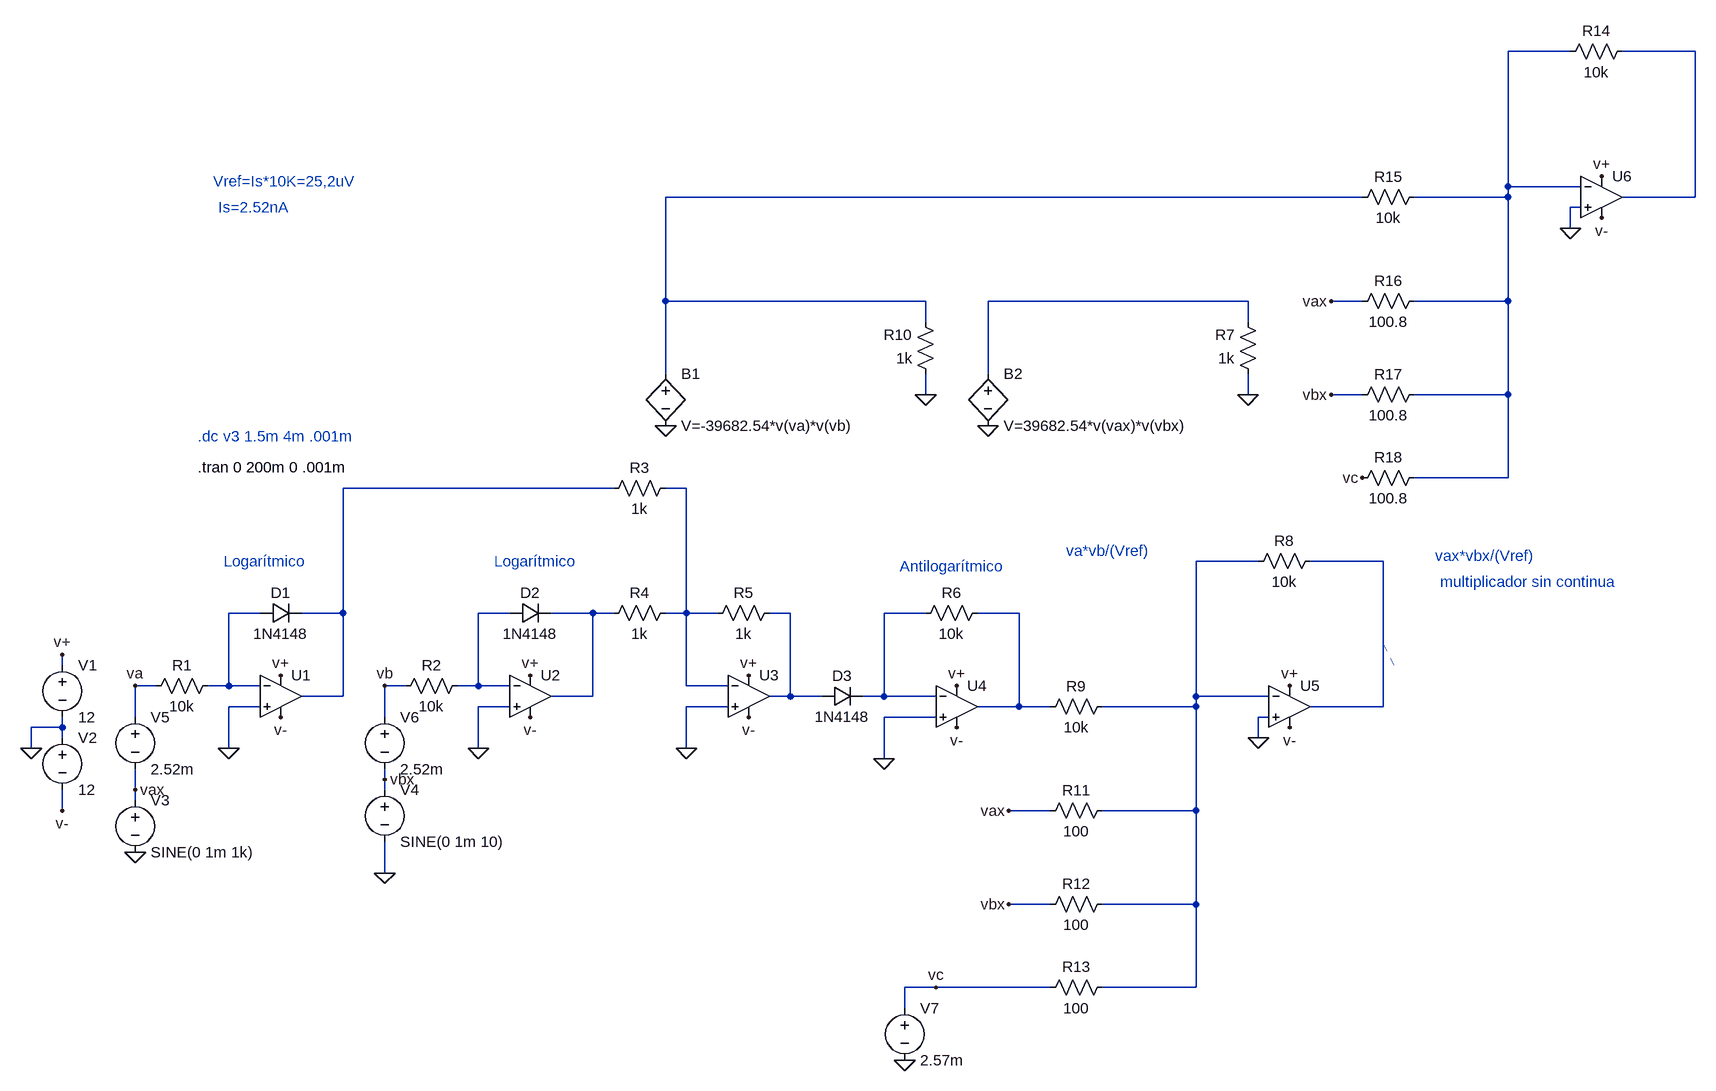
[diagram p0: schematic Multiplicador.asc]
Multiplicador.asc, the LTspice schematic file:
Version 4
SHEET 1 1492 680
WIRE 1296 -1200 1200 -1200
WIRE 1488 -1200 1376 -1200
WIRE 1200 -992 1200 -1200
WIRE 1312 -992 1200 -992
WIRE 976 -976 -96 -976
WIRE 1200 -976 1200 -992
WIRE 1200 -976 1056 -976
WIRE 1488 -976 1488 -1200
WIRE 1488 -976 1376 -976
WIRE 1312 -960 1296 -960
WIRE 1296 -928 1296 -960
WIRE -96 -816 -96 -976
WIRE 304 -816 -96 -816
WIRE 800 -816 400 -816
WIRE 976 -816 928 -816
WIRE 1200 -816 1200 -976
WIRE 1200 -816 1056 -816
WIRE 304 -784 304 -816
WIRE 800 -784 800 -816
WIRE -96 -704 -96 -816
WIRE 400 -704 400 -816
WIRE 304 -672 304 -704
WIRE 800 -672 800 -704
WIRE 976 -672 928 -672
WIRE 1200 -672 1200 -816
WIRE 1200 -672 1056 -672
WIRE 1200 -544 1200 -672
WIRE 1200 -544 1056 -544
WIRE -176 -528 -592 -528
WIRE -64 -528 -96 -528
WIRE 816 -416 720 -416
WIRE 1008 -416 896 -416
WIRE -720 -336 -768 -336
WIRE -592 -336 -592 -528
WIRE -592 -336 -656 -336
WIRE -336 -336 -384 -336
WIRE -208 -336 -272 -336
WIRE -176 -336 -208 -336
WIRE -64 -336 -64 -528
WIRE -64 -336 -96 -336
WIRE -16 -336 -64 -336
WIRE 96 -336 64 -336
WIRE 304 -336 240 -336
WIRE 448 -336 384 -336
WIRE -1024 -256 -1024 -272
WIRE -880 -224 -912 -224
WIRE -768 -224 -768 -336
WIRE -768 -224 -800 -224
WIRE -720 -224 -768 -224
WIRE -496 -224 -528 -224
WIRE -384 -224 -384 -336
WIRE -384 -224 -416 -224
WIRE -336 -224 -384 -224
WIRE -64 -224 -64 -336
WIRE 0 -224 -64 -224
WIRE -592 -208 -592 -336
WIRE -592 -208 -656 -208
WIRE -208 -208 -208 -336
WIRE -208 -208 -272 -208
WIRE 96 -208 96 -336
WIRE 96 -208 64 -208
WIRE 144 -208 96 -208
WIRE 240 -208 240 -336
WIRE 240 -208 208 -208
WIRE 320 -208 240 -208
WIRE 720 -208 720 -416
WIRE 832 -208 720 -208
WIRE -720 -192 -768 -192
WIRE -336 -192 -384 -192
WIRE 0 -192 -64 -192
WIRE 448 -192 448 -336
WIRE 448 -192 384 -192
WIRE 496 -192 448 -192
WIRE 720 -192 720 -208
WIRE 720 -192 576 -192
WIRE 1008 -192 1008 -416
WIRE 1008 -192 896 -192
WIRE -912 -176 -912 -224
WIRE -528 -176 -528 -224
WIRE 320 -176 240 -176
WIRE 832 -176 816 -176
WIRE -1024 -160 -1024 -176
WIRE -1024 -160 -1072 -160
WIRE -1024 -144 -1024 -160
WIRE 816 -144 816 -176
WIRE -1072 -128 -1072 -160
WIRE -768 -128 -768 -192
WIRE -384 -128 -384 -192
WIRE -64 -128 -64 -192
WIRE 240 -112 240 -176
WIRE -528 -80 -528 -96
WIRE -912 -64 -912 -96
WIRE -528 -64 -528 -80
WIRE -912 -48 -912 -64
WIRE -1024 -32 -1024 -64
WIRE 496 -32 432 -32
WIRE 720 -32 720 -192
WIRE 720 -32 576 -32
WIRE -528 64 -528 16
WIRE 496 112 432 112
WIRE 720 112 720 -32
WIRE 720 112 576 112
WIRE 320 240 272 240
WIRE 496 240 320 240
WIRE 720 240 720 112
WIRE 720 240 576 240
WIRE 272 272 272 240
FLAG -1072 -128 0
FLAG -912 32 0
FLAG -768 -128 0
FLAG -528 64 0
FLAG -384 -128 0
FLAG -64 -128 0
FLAG 240 -112 0
FLAG -912 -224 va
FLAG -528 -224 vb
FLAG -96 -624 0
FLAG 304 -672 0
FLAG -1024 -272 v+
FLAG -688 -240 v+
FLAG -304 -240 v+
FLAG 32 -240 v+
FLAG 352 -224 v+
FLAG -1024 -32 v-
FLAG -688 -176 v-
FLAG -304 -176 v-
FLAG 32 -176 v-
FLAG 352 -160 v-
FLAG -912 -64 vax
FLAG -528 -80 vbx
FLAG 400 -624 0
FLAG 800 -672 0
FLAG 864 -224 v+
FLAG 864 -160 v-
FLAG 816 -144 0
FLAG 432 -32 vax
FLAG 432 112 vbx
FLAG 272 352 0
FLAG 1344 -1008 v+
FLAG 1344 -944 v-
FLAG 1296 -928 0
FLAG 928 -816 vax
FLAG 928 -672 vbx
FLAG 320 240 vc
FLAG 976 -544 vc
SYMBOL Opamps\\UniversalOpamp2 -688 -208 R0
SYMATTR InstName U1
SYMBOL diode -720 -320 R270
WINDOW 0 32 32 VTop 2
WINDOW 3 0 32 VBottom 2
SYMATTR InstName D1
SYMATTR Value 1N4148
SYMBOL voltage -1024 -272 R0
WINDOW 123 0 0 Left 2
WINDOW 39 0 0 Left 2
SYMATTR InstName V1
SYMATTR Value 12
SYMBOL voltage -1024 -160 R0
WINDOW 123 0 0 Left 2
WINDOW 39 0 0 Left 2
SYMATTR InstName V2
SYMATTR Value 12
SYMBOL res -784 -240 R90
WINDOW 0 0 56 VBottom 2
WINDOW 3 32 56 VTop 2
SYMATTR InstName R1
SYMATTR Value 10k
SYMBOL voltage -912 -64 R0
WINDOW 123 0 0 Left 2
WINDOW 39 0 0 Left 2
SYMATTR InstName V3
SYMATTR Value SINE(0 1m 1k)
SYMBOL Opamps\\UniversalOpamp2 -304 -208 R0
SYMATTR InstName U2
SYMBOL diode -336 -320 R270
WINDOW 0 32 32 VTop 2
WINDOW 3 0 32 VBottom 2
SYMATTR InstName D2
SYMATTR Value 1N4148
SYMBOL res -400 -240 R90
WINDOW 0 0 56 VBottom 2
WINDOW 3 32 56 VTop 2
SYMATTR InstName R2
SYMATTR Value 10k
SYMBOL voltage -528 -80 R0
WINDOW 123 0 0 Left 2
WINDOW 39 0 0 Left 2
SYMATTR InstName V4
SYMATTR Value SINE(0 1m 10)
SYMBOL Opamps\\UniversalOpamp2 32 -208 R0
SYMATTR InstName U3
SYMBOL res -80 -544 R90
WINDOW 0 0 56 VBottom 2
WINDOW 3 32 56 VTop 2
SYMATTR InstName R3
SYMATTR Value 1k
SYMBOL res -80 -352 R90
WINDOW 0 0 56 VBottom 2
WINDOW 3 32 56 VTop 2
SYMATTR InstName R4
SYMATTR Value 1k
SYMBOL res 80 -352 R90
WINDOW 0 0 56 VBottom 2
WINDOW 3 32 56 VTop 2
SYMATTR InstName R5
SYMATTR Value 1k
SYMBOL Opamps\\UniversalOpamp2 352 -192 R0
SYMATTR InstName U4
SYMBOL diode 144 -192 R270
WINDOW 0 32 32 VTop 2
WINDOW 3 0 32 VBottom 2
SYMATTR InstName D3
SYMATTR Value 1N4148
SYMBOL res 400 -352 R90
WINDOW 0 0 56 VBottom 2
WINDOW 3 32 56 VTop 2
SYMATTR InstName R6
SYMATTR Value 10k
SYMBOL bv -96 -720 R0
SYMATTR InstName B1
SYMATTR Value V=-39682.54*v(va)*v(vb)
SYMBOL res 320 -688 R180
WINDOW 0 36 76 Left 2
WINDOW 3 36 40 Left 2
SYMATTR InstName R10
SYMATTR Value 1k
SYMBOL voltage -912 -192 R0
WINDOW 123 0 0 Left 0
WINDOW 39 0 0 Left 0
SYMATTR InstName V5
SYMATTR Value 2.52m
SYMBOL voltage -528 -192 R0
WINDOW 123 0 0 Left 0
WINDOW 39 0 0 Left 0
SYMATTR InstName V6
SYMATTR Value 2.52m
SYMBOL bv 400 -720 R0
SYMATTR InstName B2
SYMATTR Value V=39682.54*v(vax)*v(vbx)
SYMBOL res 816 -688 R180
WINDOW 0 36 76 Left 2
WINDOW 3 36 40 Left 2
SYMATTR InstName R7
SYMATTR Value 1k
SYMBOL Opamps\\UniversalOpamp2 864 -192 R0
SYMATTR InstName U5
SYMBOL res 912 -432 R90
WINDOW 0 0 56 VBottom 2
WINDOW 3 32 56 VTop 2
SYMATTR InstName R8
SYMATTR Value 10k
SYMBOL res 592 -208 R90
WINDOW 0 0 56 VBottom 2
WINDOW 3 32 56 VTop 2
SYMATTR InstName R9
SYMATTR Value 10k
SYMBOL res 592 -48 R90
WINDOW 0 0 56 VBottom 2
WINDOW 3 32 56 VTop 2
SYMATTR InstName R11
SYMATTR Value 100
SYMBOL res 592 96 R90
WINDOW 0 0 56 VBottom 2
WINDOW 3 32 56 VTop 2
SYMATTR InstName R12
SYMATTR Value 100
SYMBOL res 592 224 R90
WINDOW 0 0 56 VBottom 2
WINDOW 3 32 56 VTop 2
SYMATTR InstName R13
SYMATTR Value 100
SYMBOL voltage 272 256 R0
WINDOW 123 0 0 Left 0
WINDOW 39 0 0 Left 0
SYMATTR InstName V7
SYMATTR Value 2.57m
SYMBOL Opamps\\UniversalOpamp2 1344 -976 R0
SYMATTR InstName U6
SYMBOL res 1392 -1216 R90
WINDOW 0 0 56 VBottom 2
WINDOW 3 32 56 VTop 2
SYMATTR InstName R14
SYMATTR Value 10k
SYMBOL res 1072 -992 R90
WINDOW 0 0 56 VBottom 2
WINDOW 3 32 56 VTop 2
SYMATTR InstName R15
SYMATTR Value 10k
SYMBOL res 1072 -832 R90
WINDOW 0 0 56 VBottom 2
WINDOW 3 32 56 VTop 2
SYMATTR InstName R16
SYMATTR Value 100.8
SYMBOL res 1072 -688 R90
WINDOW 0 0 56 VBottom 2
WINDOW 3 32 56 VTop 2
SYMATTR InstName R17
SYMATTR Value 100.8
SYMBOL res 1072 -560 R90
WINDOW 0 0 56 VBottom 2
WINDOW 3 32 56 VTop 2
SYMATTR InstName R18
SYMATTR Value 100.8
TEXT -816 -608 Left 2 ;.dc v3 1.5m 4m .001m
TEXT -816 -560 Left 2 !.tran 0 200m 0 .001m
TEXT -776 -416 Left 2 ;Logarítmico
TEXT -360 -416 Left 2 ;Logarítmico
TEXT 264 -408 Left 2 ;Antilogarítmico
TEXT 520 -432 Left 2 ;va*vb/(Vref)
TEXT 1088 -424 Left 2 ;vax*vbx/(Vref)
TEXT 1096 -384 Left 2 ;multiplicador sin continua
TEXT -792 -1000 Left 2 ;Vref=Is*10K=25,2uV
TEXT -784 -960 Left 2 ;Is=2.52nA
LINE Normal 1008 -288 1024 -256 2

The netlist it stands for:
* Multiplicador.asc
XU1 0 N009 v+ v- N005 level.2 Avol=1Meg GBW=10Meg Slew=10Meg ilimit=25m rail=0 Vos=0 phimargin=45 en=0 enk=0 in=0 ink=0 Rin=500Meg  ; pins IN+ IN- V+ V- OUT
D1 N009 N005 1N4148
V1 v+ 0 12
V2 0 v- 12
R1 N009 va 10k
V3 vax 0 SINE(0 1m 1k)
XU2 0 N010 v+ v- N011 level.2 Avol=1Meg GBW=10Meg Slew=10Meg ilimit=25m rail=0 Vos=0 phimargin=45 en=0 enk=0 in=0 ink=0 Rin=500Meg  ; pins IN+ IN- V+ V- OUT
D2 N010 N011 1N4148
R2 N010 vb 10k
V4 vbx 0 SINE(0 1m 10)
XU3 0 N006 v+ v- N012 level.2 Avol=1Meg GBW=10Meg Slew=10Meg ilimit=25m rail=0 Vos=0 phimargin=45 en=0 enk=0 in=0 ink=0 Rin=500Meg  ; pins IN+ IN- V+ V- OUT
R3 N006 N005 1k
R4 N006 N011 1k
R5 N012 N006 1k
XU4 0 N013 v+ v- N014 level.2 Avol=1Meg GBW=10Meg Slew=10Meg ilimit=25m rail=0 Vos=0 phimargin=45 en=0 enk=0 in=0 ink=0 Rin=500Meg  ; pins IN+ IN- V+ V- OUT
D3 N012 N013 1N4148
R6 N014 N013 10k
B1 N003 0 V=-39682.54*v(va)*v(vb)
R10 0 N003 1k
V5 va vax 2.52m
V6 vb vbx 2.52m
B2 N004 0 V=39682.54*v(vax)*v(vbx)
R7 0 N004 1k
XU5 0 N007 v+ v- N008 level.2 Avol=1Meg GBW=10Meg Slew=10Meg ilimit=25m rail=0 Vos=0 phimargin=45 en=0 enk=0 in=0 ink=0 Rin=500Meg  ; pins IN+ IN- V+ V- OUT
R8 N008 N007 10k
R9 N007 N014 10k
R11 N007 vax 100
R12 N007 vbx 100
R13 N007 vc 100
V7 vc 0 2.57m
XU6 0 N001 v+ v- N002 level.2 Avol=1Meg GBW=10Meg Slew=10Meg ilimit=25m rail=0 Vos=0 phimargin=45 en=0 enk=0 in=0 ink=0 Rin=500Meg  ; pins IN+ IN- V+ V- OUT
R14 N002 N001 10k
R15 N001 N003 10k
R16 N001 vax 100.8
R17 N001 vbx 100.8
R18 N001 vc 100.8
.model D D
.lib standard.dio
* .dc v3 1.5m 4m .001m
.tran 0 200m 0 .001m
* Logarítmico
* Logarítmico
* Antilogarítmico
* va*vb/(Vref)
* vax*vbx/(Vref)
* multiplicador sin continua
* Vref=Is*10K=25,2uV
* Is=2.52nA
.lib UniversalOpamps2.sub
.backanno
.end